# Altium schematic sheet circuit2_ver2.SchDoc
size A4
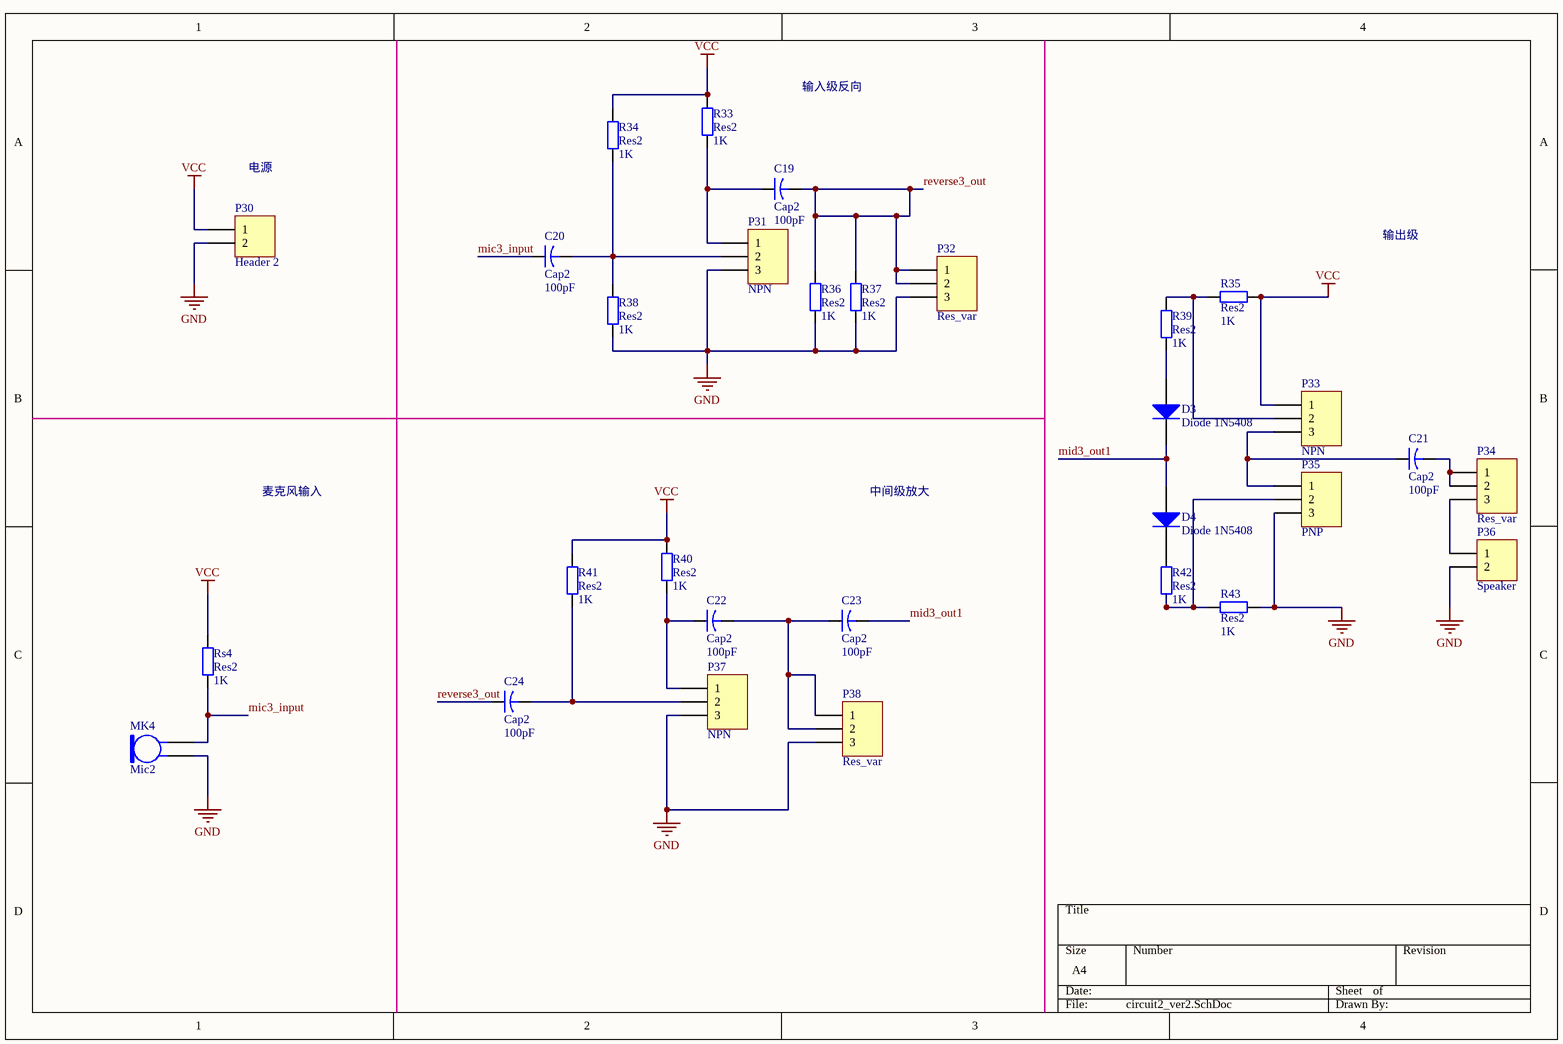
[diagram p0: circuit2_ver2.SchDoc]

## Parts
C19  Cap2  value 100pF  [CAPR5-4X5]
C20  Cap2  value 100pF  [CAPR5-4X5]
C21  Cap2  value 100pF  [CAPR5-4X5]
C22  Cap2  value 100pF  [CAPR5-4X5]
C23  Cap2  value 100pF  [CAPR5-4X5]
C24  Cap2  value 100pF  [CAPR5-4X5]
D3  Diode 1N5408  [DO-201AD]
D4  Diode 1N5408  [DO-201AD]
MK4  Mic2  [PIN2]
P30  Header 2  [HDR1X2]
P31  NPN  [HDR1X3]
P32  Res_var  [HDR1X3]
P33  NPN  [HDR1X3]
P34  Res_var  [HDR1X3]
P35  PNP  [HDR1X3]
P36  Speaker  [HDR1X2]
P37  NPN  [HDR1X3]
P38  Res_var  [HDR1X3]
R33  Res2  value 1K  [AXIAL-0.4]
R34  Res2  value 1K  [AXIAL-0.4]
R35  Res2  value 1K  [AXIAL-0.4]
R36  Res2  value 1K  [AXIAL-0.4]
R37  Res2  value 1K  [AXIAL-0.4]
R38  Res2  value 1K  [AXIAL-0.4]
R39  Res2  value 1K  [AXIAL-0.4]
R40  Res2  value 1K  [AXIAL-0.4]
R41  Res2  value 1K  [AXIAL-0.4]
R42  Res2  value 1K  [AXIAL-0.4]
R43  Res2  value 1K  [AXIAL-0.4]
Rs4  Res2  value 1K  [AXIAL-0.4]

## Nets
GND: MK4.1 P30.2 P31.3 P32.3 P35.3 P36.2 P37.3 P38.3 R36.1 R37.1 R38.1 R43.1
VCC: P30.1 P33.1 R33.2 R34.2 R35.1 R40.2 R41.2 Rs4.2
mic3_input: C20.1 MK4.2 Rs4.1
mid3_out1: C23.2 D3.2(K) D4.1(A)
reverse3_out: C19.2 C24.1 P32.1 P32.2 R36.2 R37.2
NetC19_1: C19.1 P31.1 R33.1
NetC20_2: C20.2 P31.2 R34.1 R38.2
NetC21_1: C21.1 P33.3 P35.1
NetC21_2: C21.2 P34.1 P34.2
NetC22_1: C22.1 P37.1 R40.1
NetC22_2: C22.2 C23.1 P38.1 P38.2
NetC24_2: C24.2 P37.2 R41.1
NetD3_1: D3.1(A) R39.1
NetD4_2: D4.2(K) R42.2
NetP33_2: P33.2 R35.2 R39.2
NetP34_3: P34.3 P36.1
NetP35_2: P35.2 R42.1 R43.2

## Notes on the sheet
- 输入级反向
- 电源
- 输出级
- 麦克风输入
- 中间级放大

## Library data of the parts
C19-C24 = Cap2: Capacitor; Published: 23-Sep-2002; PackageReference: CAPR5-4X5; Publisher: Altium Limited; PackageDescription: Capacitor; 2 Leads
D3 D4 = Diode 1N5408: 3 Amp Medium Power Silicon Rectifier Diode; Published: 8-Jun-2000; LatestRevisionDate: 17-Jul-2002; LatestRevisionNote: Re-released for DXP Platform.; DatasheetVersion: Aug-1984; PackageReference: DO-201AD; Publisher: Altium Limited; PackageDescription: Diode, Axial; Body 9.5 x 5.3 mm (LxDia. max), Lead Dia. 1.32 mm (max); ComponentLink1Description: Manufacturer Link; ComponentLink1URL: http://www.irf.com/
MK4 = Mic2: Microphone; Published: 24-Mar-1999; LatestRevisionDate: 17-Jul-2002; LatestRevisionNote: Re-released for DXP Platform.; PackageReference: PIN2; Publisher: Altium Limited
P30 P36 = Header 2: Header, 2-Pin; LatestRevisionDate: 17-Jul-2002; LatestRevisionNote: Re-released for DXP Platform.; Publisher: Altium Limited
P31-P35 P37 P38 = Header 3: Header, 3-Pin; LatestRevisionDate: 17-Jul-2002; LatestRevisionNote: Re-released for DXP Platform.; Publisher: Altium Limited
R33-R43 Rs4 = Res2: Resistor; Published: 8-Jun-2000; LatestRevisionDate: 17-Jul-2002; LatestRevisionNote: Re-released for DXP Platform.; PackageReference: AXIAL-0.4; Publisher: Altium Limited; PackageDescription: Axial Device, Thru-Hole; 2 Leads; 0.4 in Pin Spacing